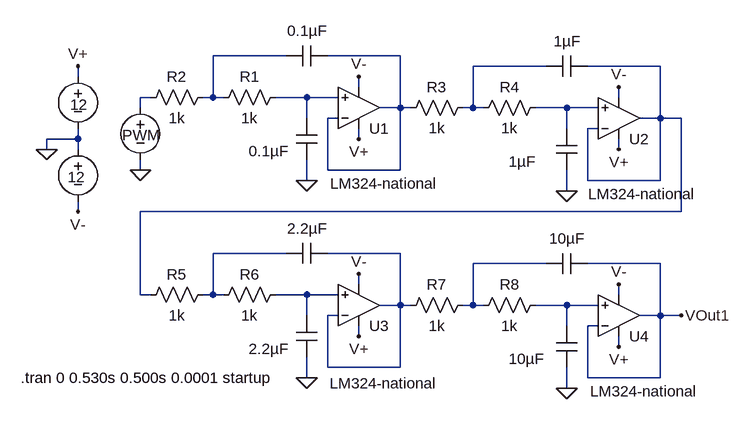
[diagram p0: schematic lopass2.asc]
lopass2.asc, the LTspice schematic file:
Version 4
SHEET 1 1456 680
WIRE -272 -48 -384 -48
WIRE -96 -48 -208 -48
WIRE 128 -32 16 -32
WIRE 304 -32 192 -32
WIRE -592 -16 -592 -32
WIRE -160 0 -160 -16
WIRE -480 16 -496 16
WIRE -384 16 -384 -48
WIRE -384 16 -400 16
WIRE -368 16 -384 16
WIRE -240 16 -288 16
WIRE -192 16 -240 16
WIRE 240 16 240 0
WIRE -496 32 -496 16
WIRE -96 32 -96 -48
WIRE -96 32 -128 32
WIRE -80 32 -96 32
WIRE 16 32 16 -32
WIRE 16 32 0 32
WIRE 32 32 16 32
WIRE 160 32 112 32
WIRE 208 32 160 32
WIRE -240 48 -240 16
WIRE -192 48 -208 48
WIRE 304 48 304 -32
WIRE 304 48 272 48
WIRE 336 48 304 48
WIRE 160 64 160 32
WIRE 208 64 192 64
WIRE -592 80 -592 64
WIRE -592 80 -640 80
WIRE -160 80 -160 64
WIRE -640 96 -640 80
WIRE -592 96 -592 80
WIRE 240 96 240 80
WIRE -496 128 -496 112
WIRE -208 128 -208 48
WIRE -96 128 -96 32
WIRE -96 128 -208 128
WIRE -240 144 -240 112
WIRE 192 144 192 64
WIRE 304 144 304 48
WIRE 304 144 192 144
WIRE 160 160 160 128
WIRE -592 192 -592 176
WIRE 336 192 336 48
WIRE 336 192 -496 192
WIRE -272 256 -384 256
WIRE -96 256 -208 256
WIRE 128 272 16 272
WIRE 304 272 192 272
WIRE -160 304 -160 288
WIRE -496 320 -496 192
WIRE -480 320 -496 320
WIRE -384 320 -384 256
WIRE -384 320 -400 320
WIRE -368 320 -384 320
WIRE -240 320 -288 320
WIRE -192 320 -240 320
WIRE 240 320 240 304
WIRE -96 336 -96 256
WIRE -96 336 -128 336
WIRE -80 336 -96 336
WIRE 16 336 16 272
WIRE 16 336 0 336
WIRE 32 336 16 336
WIRE 160 336 112 336
WIRE 208 336 160 336
WIRE -240 352 -240 320
WIRE -192 352 -208 352
WIRE 304 352 304 272
WIRE 304 352 272 352
WIRE 336 352 304 352
WIRE 160 368 160 336
WIRE 208 368 192 368
WIRE -160 384 -160 368
WIRE 240 400 240 384
WIRE -208 432 -208 352
WIRE -96 432 -96 336
WIRE -96 432 -208 432
WIRE -240 448 -240 416
WIRE 192 448 192 368
WIRE 304 448 304 352
WIRE 304 448 192 448
WIRE 160 464 160 432
FLAG -592 -32 V+
FLAG -160 80 V+
FLAG -160 -16 V-
FLAG -592 192 V-
FLAG -240 144 0
FLAG -496 128 0
FLAG -640 96 0
FLAG 240 96 V+
FLAG 240 0 V-
FLAG 160 160 0
FLAG -160 384 V+
FLAG -160 288 V-
FLAG -240 448 0
FLAG 240 400 V+
FLAG 240 304 V-
FLAG 336 352 VOut1
FLAG 160 464 0
SYMBOL voltage -496 16 R0
WINDOW 0 -28 58 Left 2
WINDOW 3 24 96 Invisible 2
WINDOW 39 0 0 Left 2
SYMATTR InstName PWM
SYMATTR Value PULSE(0 5 0 0.01ms 0.01ms 1.020ms 2.040ms)
SYMATTR Value2 AC AC 1.
SYMBOL voltage -592 -32 R0
WINDOW 0 24 16 Invisible 2
WINDOW 3 -12 59 Left 2
WINDOW 123 0 0 Left 2
WINDOW 39 0 0 Left 2
SYMATTR InstName V1
SYMATTR Value 12
SYMBOL voltage -592 80 R0
WINDOW 0 24 16 Invisible 2
WINDOW 3 -16 59 Left 2
WINDOW 123 0 0 Left 2
WINDOW 39 0 0 Left 2
SYMATTR InstName V2
SYMATTR Value 12
SYMBOL Opamps\\LM324-national -160 96 M180
WINDOW 3 -44 -53 Left 2
SYMATTR InstName U1
SYMBOL res -384 0 R90
WINDOW 0 0 56 VBottom 2
WINDOW 3 32 56 VTop 2
SYMATTR InstName R2
SYMATTR Value 1k
SYMBOL cap -256 48 R0
WINDOW 0 24 8 Invisible 2
WINDOW 3 -73 51 Left 2
SYMATTR InstName C2
SYMATTR Value 0.1µF
SYMBOL res -272 0 R90
WINDOW 0 0 56 VBottom 2
WINDOW 3 32 56 VTop 2
SYMATTR InstName R1
SYMATTR Value 1k
SYMBOL cap -208 -64 R90
WINDOW 0 0 32 Invisible 2
WINDOW 3 -38 31 VTop 2
SYMATTR InstName C1
SYMATTR Value 0.1µF
SYMBOL Opamps\\LM324-national 240 112 M180
WINDOW 3 -47 -53 Left 2
SYMATTR InstName U2
SYMBOL res 16 16 R90
WINDOW 0 0 56 VBottom 2
WINDOW 3 32 56 VTop 2
SYMATTR InstName R3
SYMATTR Value 1k
SYMBOL cap 144 64 R0
WINDOW 0 24 8 Invisible 2
WINDOW 3 -73 51 Left 2
SYMATTR InstName C3
SYMATTR Value 1µF
SYMBOL res 128 16 R90
WINDOW 0 0 56 VBottom 2
WINDOW 3 32 56 VTop 2
SYMATTR InstName R4
SYMATTR Value 1k
SYMBOL cap 192 -48 R90
WINDOW 0 0 32 Invisible 2
WINDOW 3 -38 31 VTop 2
SYMATTR InstName C4
SYMATTR Value 1µF
SYMBOL Opamps\\LM324-national -160 400 M180
WINDOW 3 -45 -56 Left 2
SYMATTR InstName U3
SYMBOL res -384 304 R90
WINDOW 0 0 56 VBottom 2
WINDOW 3 32 56 VTop 2
SYMATTR InstName R5
SYMATTR Value 1k
SYMBOL cap -256 352 R0
WINDOW 0 24 8 Invisible 2
WINDOW 3 -73 51 Left 2
SYMATTR InstName C5
SYMATTR Value 2.2µF
SYMBOL res -272 304 R90
WINDOW 0 0 56 VBottom 2
WINDOW 3 32 56 VTop 2
SYMATTR InstName R6
SYMATTR Value 1k
SYMBOL cap -208 240 R90
WINDOW 0 0 32 Invisible 2
WINDOW 3 -38 31 VTop 2
SYMATTR InstName C6
SYMATTR Value 2.2µF
SYMBOL Opamps\\LM324-national 240 416 M180
WINDOW 3 -44 -53 Left 2
SYMATTR InstName U4
SYMBOL res 16 320 R90
WINDOW 0 0 56 VBottom 2
WINDOW 3 32 56 VTop 2
SYMATTR InstName R7
SYMATTR Value 1k
SYMBOL cap 144 368 R0
WINDOW 0 24 8 Invisible 2
WINDOW 3 -73 51 Left 2
SYMATTR InstName C7
SYMATTR Value 10µF
SYMBOL res 128 320 R90
WINDOW 0 0 56 VBottom 2
WINDOW 3 32 56 VTop 2
SYMATTR InstName R8
SYMATTR Value 1k
SYMBOL cap 192 256 R90
WINDOW 0 0 32 Invisible 2
WINDOW 3 -38 31 VTop 2
SYMATTR InstName C8
SYMATTR Value 10µF
TEXT -680 448 Left 2 !.tran 0 0.530s 0.500s 0.0001 startup

The netlist it stands for:
* lopass2.asc
V§PWM N005 0 PULSE(0 5 0 0.01ms 0.01ms 1.020ms 2.040ms) AC AC 1.
V1 V+ 0 12
V2 0 V- 12
XU1 N006 N002 V+ V- N002 LM324-national  ; pins In+ In- V+ V- OUT
R2 N001 N005 1k
C2 N006 0 0.1µF
R1 N006 N001 1k
C1 N002 N001 0.1µF
XU2 N007 N004 V+ V- N004 LM324-national  ; pins In+ In- V+ V- OUT
R3 N003 N002 1k
C3 N007 0 1µF
R4 N007 N003 1k
C4 N004 N003 1µF
XU3 N011 N009 V+ V- N009 LM324-national  ; pins In+ In- V+ V- OUT
R5 N008 N004 1k
C5 N011 0 2.2µF
R6 N011 N008 1k
C6 N009 N008 2.2µF
XU4 N012 VOut1 V+ V- VOut1 LM324-national  ; pins In+ In- V+ V- OUT
R7 N010 N009 1k
C7 N012 0 10µF
R8 N012 N010 1k
C8 VOut1 N010 10µF
.tran 0 0.530s 0.500s 0.0001 startup
.backanno
.end